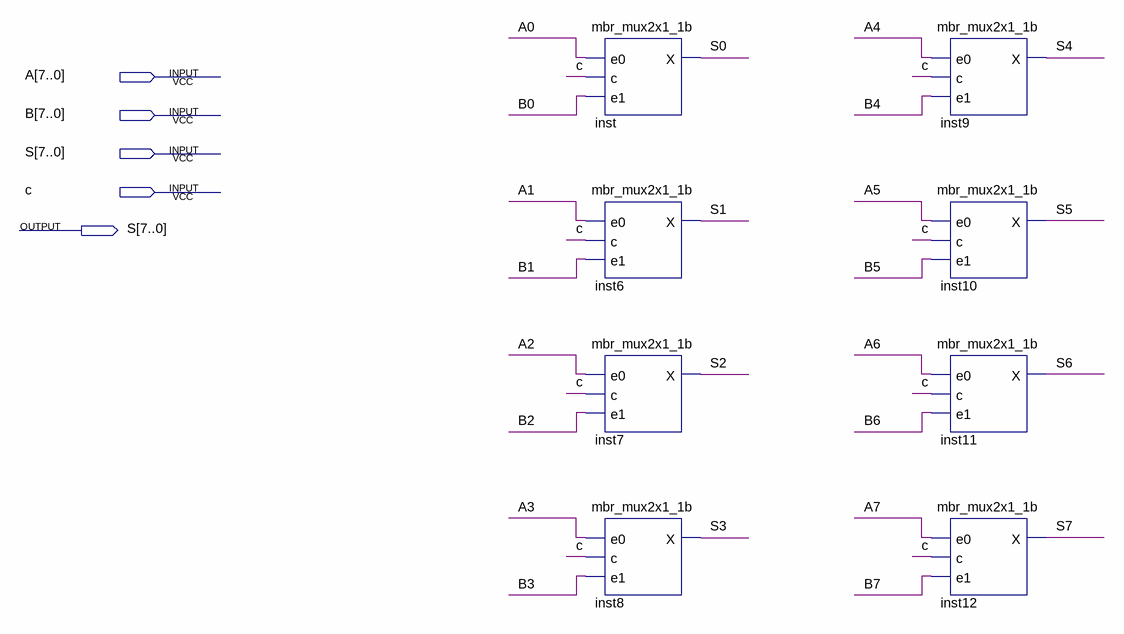
[diagram p0: schematic sheet]
// Quartus schematic mbr_mux8x1_8b.bdf as structural Verilog: 8 symbols, 5 pins
module mbr_mux8x1_8b (
  input  [7:0] A,
  input  [7:0] B,
  inout  [7:0] S,
  input  c
);

  mbr_mux2x1_1b inst (.e0(A[0]), .c(c), .e1(B[0]), .X(S[0]));
  mbr_mux2x1_1b inst6 (.e0(A[1]), .c(c), .e1(B[1]), .X(S[1]));
  mbr_mux2x1_1b inst7 (.e0(A[2]), .c(c), .e1(B[2]), .X(S[2]));
  mbr_mux2x1_1b inst8 (.e0(A[3]), .c(c), .e1(B[3]), .X(S[3]));
  mbr_mux2x1_1b inst9 (.e0(A[4]), .c(c), .e1(B[4]), .X(S[4]));
  mbr_mux2x1_1b inst10 (.e0(A[5]), .c(c), .e1(B[5]), .X(S[5]));
  mbr_mux2x1_1b inst11 (.e0(A[6]), .c(c), .e1(B[6]), .X(S[6]));
  mbr_mux2x1_1b inst12 (.e0(A[7]), .c(c), .e1(B[7]), .X(S[7]));
endmodule
